# EAGLE schematic PandaSat_Payload (EAGLE 9.2.2)

## Sheet 1 of 2: GPS and Single Board Computer
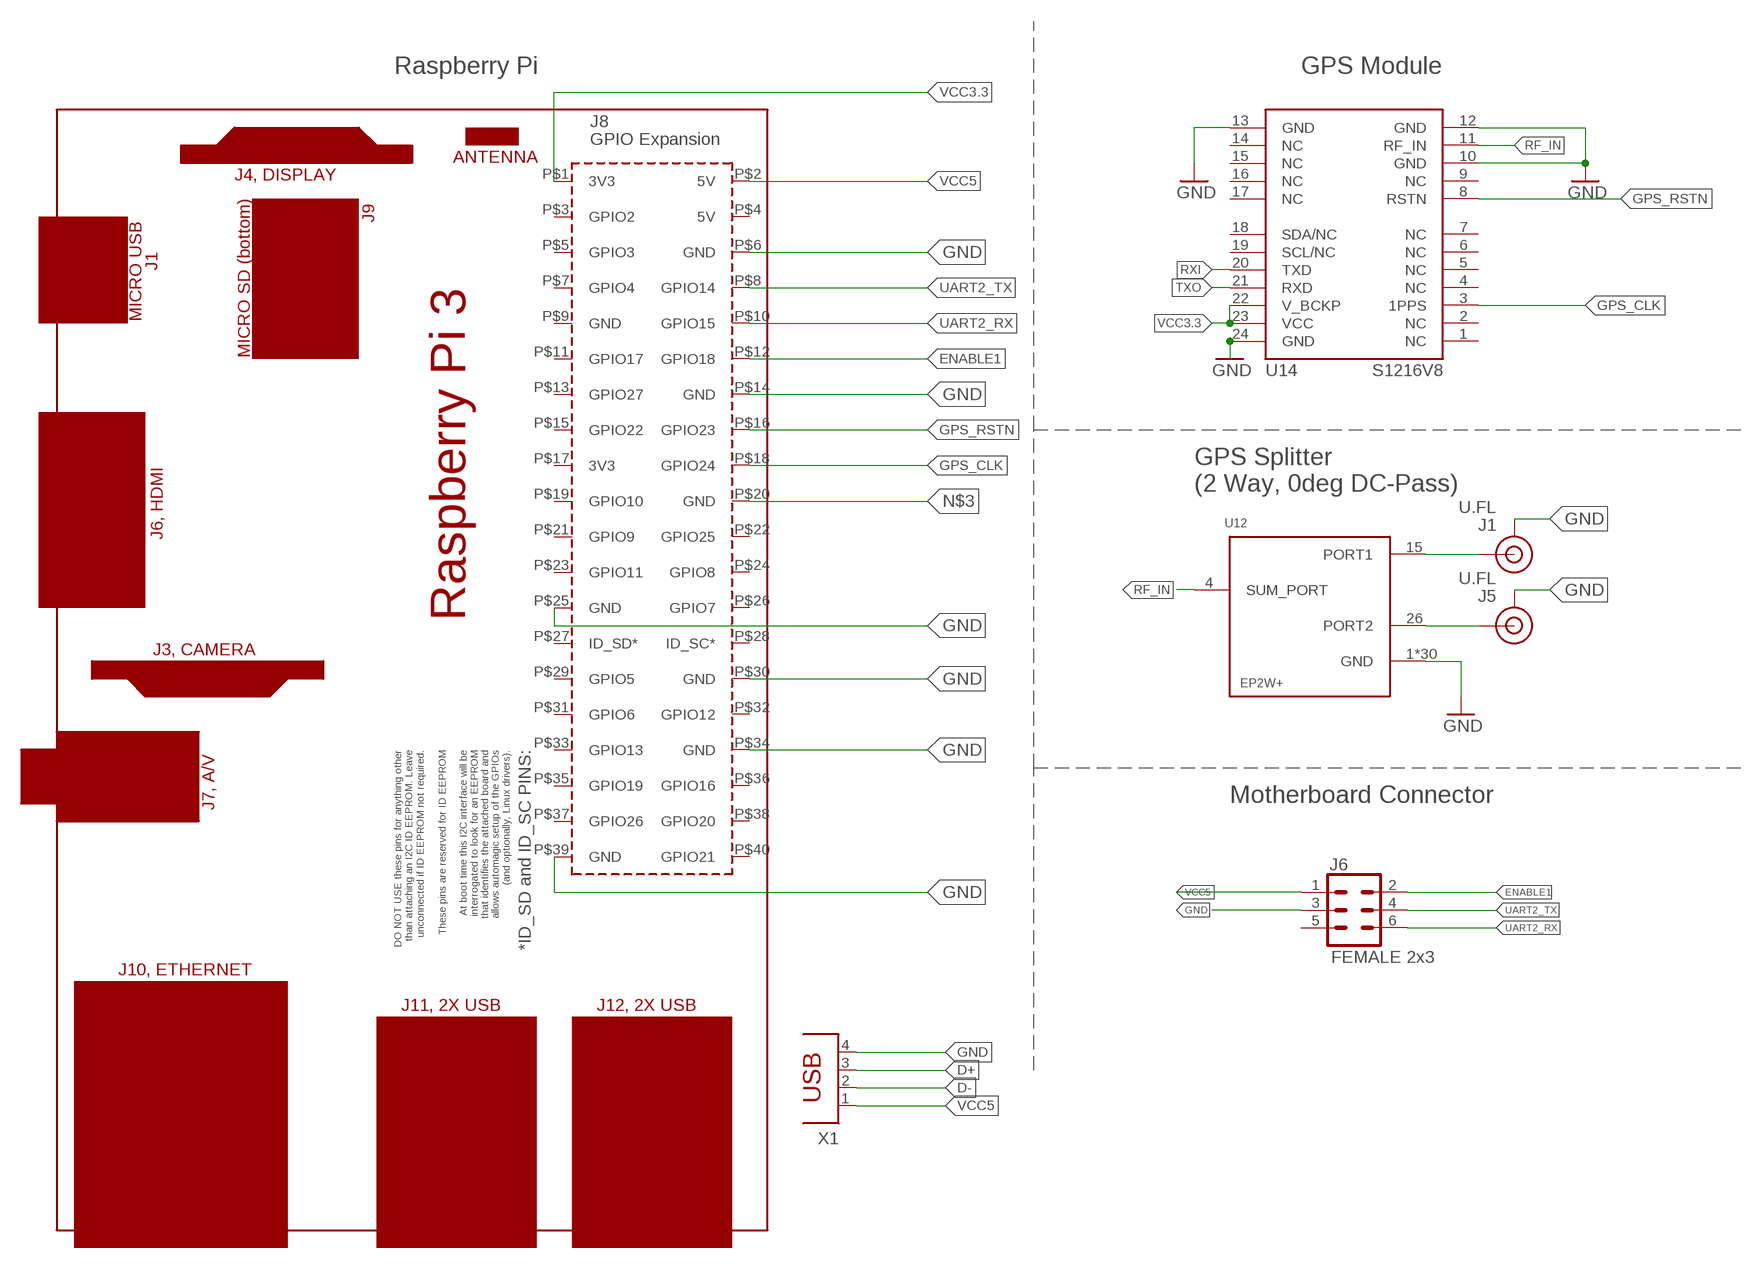
[diagram p0: schematic, sheet 1]

### Parts
J1  U.FL  U.FL2PIN  [U.FL]
J5  U.FL  U.FL2PIN  [U.FL]
J6  FEMALE 2x3  CONN_03X2FEMALE  [2X3]
PCB1  RPI3RPI3  [RPI3]
U12  EP2W+  [QFN32-5X5MM]
U14  S1216V8  [S1216_24PIN_PACKAGE]
X1  PN87520  [PN87520]

### Nets
D+: X1.3 ; also sheet 2
D-: X1.2 ; also sheet 2
ENABLE1: J6.2 PCB1.P$12(GPIO18)
GND: J1.1(GND) J1.2(GND) J5.1(GND) J5.2(GND) J6.3 PCB1.P$6(GND) PCB1.P$14(GND) PCB1.P$25(GND) PCB1.P$30(GND) PCB1.P$34(GND) PCB1.P$39(GND) U12.1(GND) U12.2(GND) U12.3(GND) U12.5(GND) U12.6(GND) U12.7(GND) U12.8(GND) U12.9(GND) U12.10(GND) U12.11(GND) U12.12(GND) U12.13(GND) U12.14(GND) U12.16(GND) U12.17(GND) U12.18(GND) U12.19(GND) U12.20(GND) U12.21(GND) U12.22(GND) U12.23(GND) U12.24(GND) U12.25(GND) U12.27(GND) U12.28(GND) U12.29(GND) U12.30(GND) U12.31(GND) U12.32(GND) U12.EP(GND) U14.10(GND) U14.12(GND) U14.13(GND) U14.24(GND) X1.4 ; also sheet 2
GPS_CLK: PCB1.P$18(GPIO24) U14.3(1PPS)
GPS_RSTN: PCB1.P$16(GPIO23) U14.8(RSTN)
N$3: PCB1.P$20(GND)
RF_IN: U12.4(SUM_PORT) U14.11(RF_IN)
RXI: U14.20(TXD) ; also sheet 2
TXO: U14.21(RXD) ; also sheet 2
U.FL1: J1.FEED(SIGNAL) U12.15(PORT1)
U.FL2: J5.FEED(SIGNAL) U12.26(PORT2)
UART2_RX: J6.6 PCB1.P$10(GPIO15)
UART2_TX: J6.4 PCB1.P$8(GPIO14)
VCC3.3: PCB1.P$1(3V3) U14.22(V_BCKP) U14.23(VCC)
VCC5: J6.1 PCB1.P$2(5V) X1.1 ; also sheet 2
Unconnected: J6.5 PCB1.P$3(GPIO2) PCB1.P$4(5V) PCB1.P$5(GPIO3) PCB1.P$7(GPIO4) PCB1.P$9(GND) PCB1.P$11(GPIO17) PCB1.P$13(GPIO27) PCB1.P$15(GPIO22) PCB1.P$17(3V3) PCB1.P$19(GPIO10) PCB1.P$21(GPIO9) PCB1.P$22(GPIO25) PCB1.P$23(GPIO11) PCB1.P$24(GPIO8) PCB1.P$26(GPIO7) PCB1.P$27(ID_SD*) PCB1.P$28(ID_SC*) PCB1.P$29(GPIO5) PCB1.P$31(GPIO6) PCB1.P$32(GPIO12) PCB1.P$33(GPIO13) PCB1.P$35(GPIO19) PCB1.P$36(GPIO16) PCB1.P$37(GPIO26) PCB1.P$38(GPIO20) PCB1.P$40(GPIO21) U14.1(NC) U14.2(NC) U14.4(NC) U14.5(NC) U14.6(NC) U14.7(NC) U14.9(NC) U14.14(NC) U14.15(NC) U14.16(NC) U14.17(NC) U14.18(SDA/NC) U14.19(SCL/NC)

### Notes on the sheet
- Raspberry Pi | GPS Module
- GPS Splitter 
  (2 Way, 0deg DC-Pass)
- Motherboard Connector

## Sheet 2 of 2: Interface USB-UART
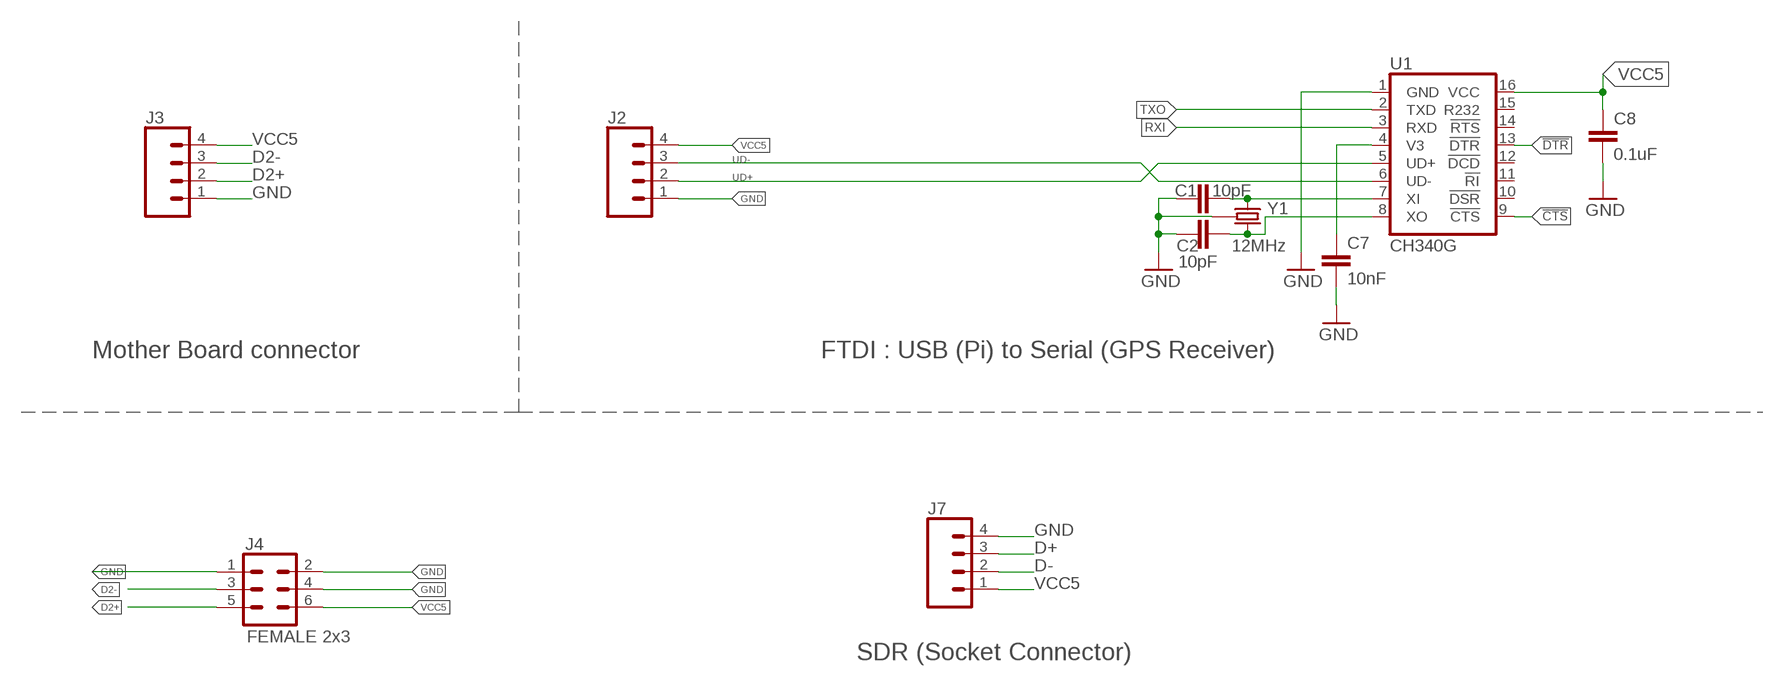
[diagram p1: schematic, sheet 2]

### Parts
C1  10pF  10PF-50V-5%(0603)  [0603-CAP]
C2  10pF  10PF-50V-5%(0603)  [0603-CAP]
C7  10nF  10NF/10000PF-50V-10%(0603)  [0603-CAP]
C8  0.1uF  0.1UF-25V(+80/-20%)(0603)  [0603-CAP]
J2  CONN_04  [1X04]
J3  CONN_04  [1X04]
J4  FEMALE 2x3  CONN_03X2FEMALE  [2X3]
J7  CONN_04  [1X04]
U1  CH340G  CH340GSMD  [SO016]
Y1  12MHz  CRYSTAL-GROUNDED3.2X2.5  [CRYSTAL-SMD-3.2X2.5]

### Nets
!CTS: U1.9(!CTS)
!DTR: U1.13(!DTR)
D2+: J3.2 J4.5
D2-: J3.3 J4.3
D+: J7.3 ; also sheet 1
D-: J7.2 ; also sheet 1
GND: C1.1 C2.1 C7.2 C8.2 J2.1 J3.1 J4.1 J4.2 J4.4 J7.4 U1.1(GND) Y1.2(GND) Y1.4(GND) ; also sheet 1
N$2: C2.2 U1.8(XO) Y1.3
N$5: C1.2 U1.7(XI) Y1.1
RXI: U1.3(RXD) ; also sheet 1
TXO: U1.2(TXD) ; also sheet 1
UD+: J2.2 U1.5(UD+)
UD-: J2.3 U1.6(UD-)
V1: C7.1 U1.4(V3)
VCC5: C8.1 J2.4 J3.4 J4.6 J7.1 U1.16(VCC) ; also sheet 1
Unconnected: U1.10(!DSR) U1.11(!RI) U1.12(!DCD) U1.14(!RTS) U1.15(R232)

### Notes on the sheet
- Mother Board connector | FTDI : USB (Pi) to Serial (GPS Receiver)
- SDR (Socket Connector)

## Library data of the parts
C1 C2 = SparkFun-Capacitors:10PF-50V-5%(0603): CAP-11812; PROD_ID: CAP-11812
C7 = SparkFun-Capacitors:10NF/10000PF-50V-10%(0603): CAP-00867; PROD_ID: CAP-00867
C8 = SparkFun-Capacitors:0.1UF-25V(+80/-20%)(0603): CAP-00810 Ceramic Standard decoupling cap; PROD_ID: CAP-00810
J1 J5 = SparkFun-Connectors:U.FL2PIN: SMD Antenna Connector - U.FL 2mm height, 3.0mm x 3.0mm receptacle size. SparkFun Products: SparkFun WiFi Shield - ESP8266 <https://www.sparkfun.com/products/13287> SparkFun ESP8266 Thing <https://www.sparkfun.com/products/13231> SparkFun MiniGen - Pro Mini Signal Generator Shield <https://www.sparkfun.com/products/11420>; PROD_ID: CONN-09193; SF_ID: WRL-09144
J2 J3 J7 = SparkFun-Connectors:CONN_04: Multi connection point. Often used as Generic Header-pin footprint for 0.1 inch spaced/style header connections On any of the 0.1 inch spaced packages, you can populate with these: Break Away Headers - Straight <https://www.sparkfun.com/products/116> (PRT-00116) Break Away Male Headers - Right Angle <https://www.sparkfun.com/products/553> (PRT-00553) Female Headers <https://www.sparkfun.com/products/115> (PRT-00115) Break Away Headers - Machine Pin <https://www.sparkfun.com/products/117> (PRT-00117) Break Away Female Headers - Swiss Machine Pin <https://www.sparkfun.com/products/743> (PRT-00743) For SCREWTERMINALS and SPRING TERMINALS visit here: Screw Terimnals on SparkFun.com <https://www.sparkfun.com/search/results?term=Screw+Terminals> (5mm/3.5mm/2.54mm spacing) This device is also useful as a general connection point to wire up your design to another part of your project. Our various solder wires solder well into these plated through hole pads. Hook-Up Wire - Assortment (Stranded, 22 AWG) <https://www.sparkfun.com/products/11375> (PRT-11375) Hook-Up Wire - Assortment (Solid Core, 22 AWG) <https://www.sparkfun.com/products/11367> (PRT-11367) View the entire wire category on our website here <https://www.sparkfun.com/categories/141> Special notes: Molex polarized connector foot print use with SKU : PRT-08231 with associated crimp pins and housings. 1MM SMD Version SKU: PRT-10208; PROD_ID: CONN-09696
J4 J6 = SparkFun-Connectors:CONN_03X2: Multi connection point. Often used as Generic Header-pin footprint for 0.1 inch spaced/style header connections You can populate with any combo of single row headers, but if you'd like an exact match, check these: Header - 2x3 (Male, 0.1") <https://www.sparkfun.com/products/12807> (PRT-12807) Header - 2x3 (Female, 0.1") <https://www.sparkfun.com/products/13010> (PRT-13010) 2x3 Pin Shrouded Header <https://www.sparkfun.com/products/10877> (PRT-10877) On any of the 0.1 inch spaced packages, you can populate with these: Break Away Headers - Straight <https://www.sparkfun.com/products/116> (PRT-00116) Break Away Male Headers - Right Angle <https://www.sparkfun.com/products/553> (PRT-00553) Female Headers <https://www.sparkfun.com/products/115> (PRT-00115) Break Away Headers - Machine Pin <https://www.sparkfun.com/products/117> (PRT-00117) Break Away Female Headers - Swiss Machine Pin <https://www.sparkfun.com/products/743> (PRT-00743) Special note: the shrouded connector mates well with our 3x2 ribbon cables: Ribbon Crimp Connector - 6-pin (2x3, Female) <https://www.sparkfun.com/products/10651> (PRT-10651) Ribbon Cable - 6 wire (15ft) <https://www.sparkfun.com/products/10646> (PRT-10646); PROD_ID: CONN-11566
PCB1 = e14_Rpi3_RevA+mirror-pcb:RPI3: Device for Raspberry Pi 3 board created by Dave Young for www.element14.com More information and support community is available at https://www.element14.com/community/community/raspberry-pi Device for Raspberry Pi 3 board updated by Gerald Schwarz for www.element14.com On RPI3 addet the layer milling and created a mirrored shield.
U1 = SparkFun-DigitalIC:CH340G: A simple USB 2.0 to Serial IC.; PROD_ID: IC-13498
U12 = maholli:EP2W+
U14 = maholli:S1216V8
X1 = con-berg:PN87520: BERG USB connector; OC_FARNELL: unknown; OC_NEWARK: unknown
Y1 = USB Basic:CRYSTAL-GROUNDED: Small, 3.2x2.5mm, SMD Crystal; PROD_ID: XTAL-13518

## Net classes
1 power: width 0.178 mm